# EAGLE schematic regBlock_slice (EAGLE 6.3)
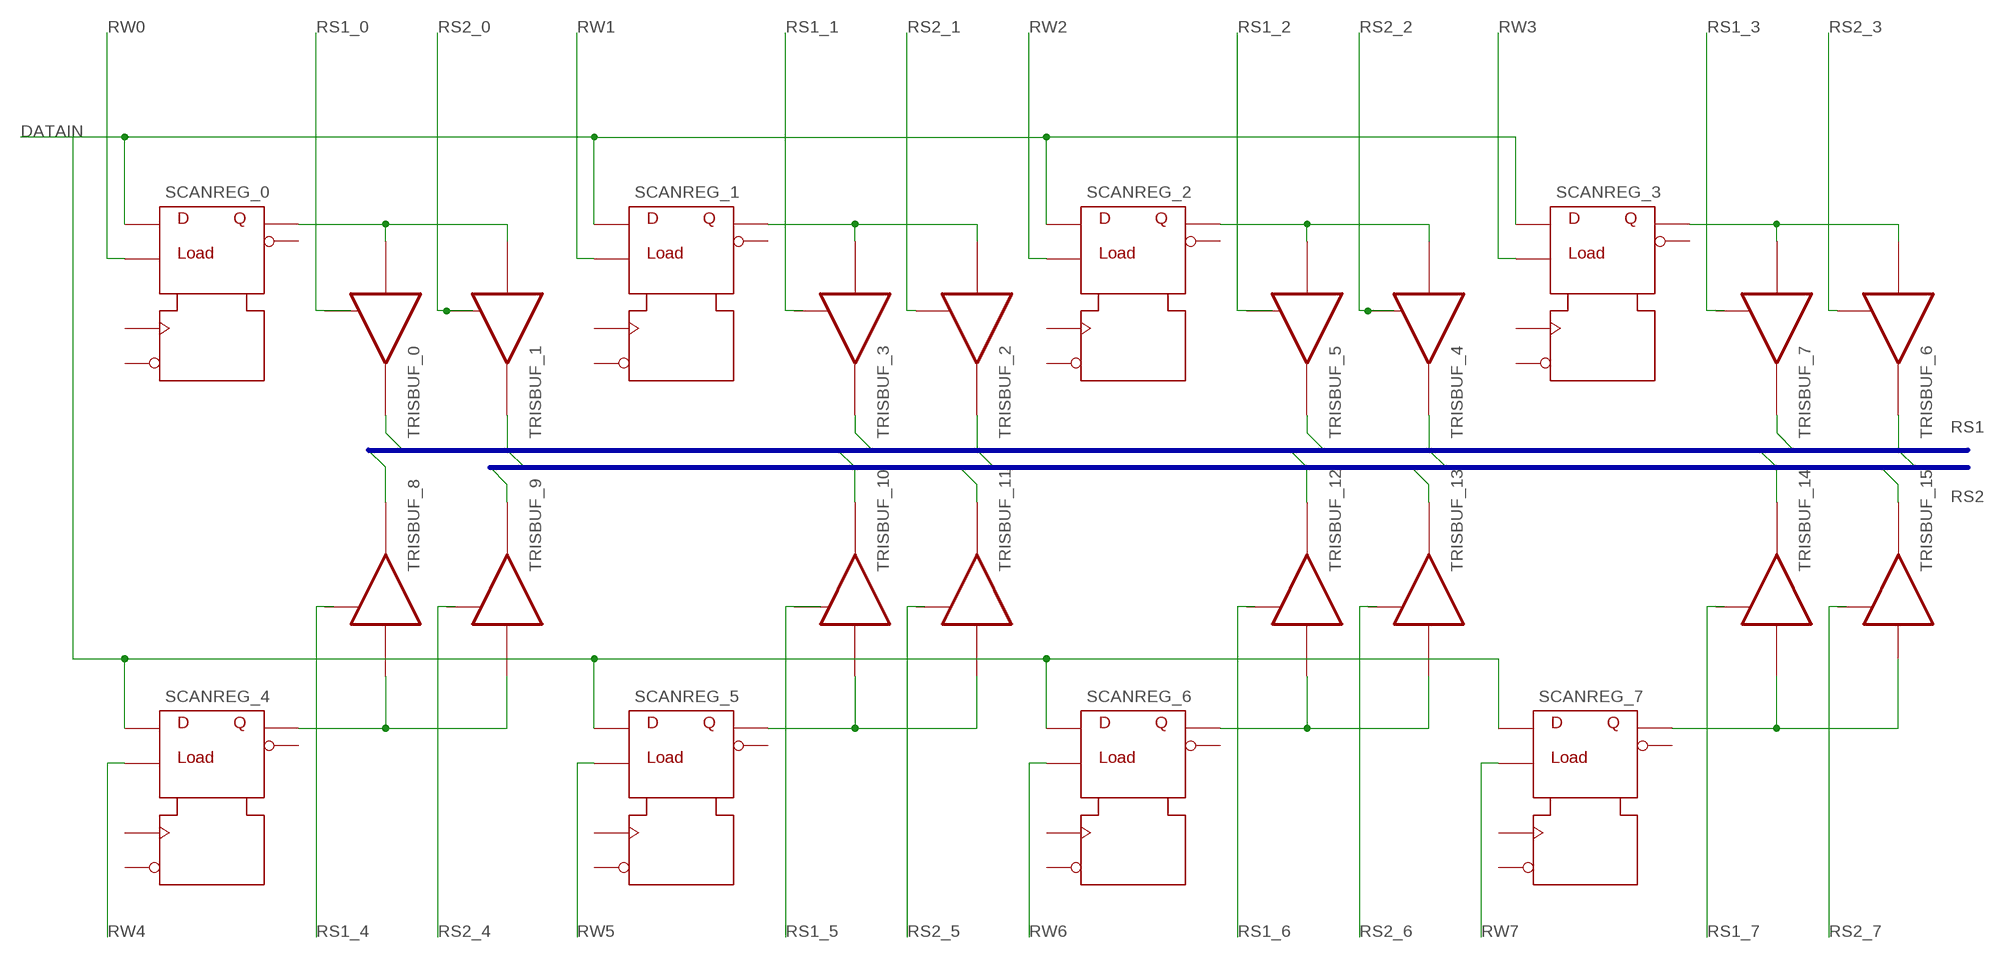
[diagram p0: schematic, sheet 1]

## Parts
SCANREG_0  SCANREG  [6PIN]
SCANREG_1  SCANREG  [6PIN]
SCANREG_2  SCANREG  [6PIN]
SCANREG_3  SCANREG  [6PIN]
SCANREG_4  SCANREG  [6PIN]
SCANREG_5  SCANREG  [6PIN]
SCANREG_6  SCANREG  [6PIN]
SCANREG_7  SCANREG  [6PIN]
TRISBUF_0  TRISBUF  [3PIN]
TRISBUF_1  TRISBUF  [3PIN]
TRISBUF_2  TRISBUF  [3PIN]
TRISBUF_3  TRISBUF  [3PIN]
TRISBUF_4  TRISBUF  [3PIN]
TRISBUF_5  TRISBUF  [3PIN]
TRISBUF_6  TRISBUF  [3PIN]
TRISBUF_7  TRISBUF  [3PIN]
TRISBUF_8  TRISBUF  [3PIN]
TRISBUF_9  TRISBUF  [3PIN]
TRISBUF_10  TRISBUF  [3PIN]
TRISBUF_11  TRISBUF  [3PIN]
TRISBUF_12  TRISBUF  [3PIN]
TRISBUF_13  TRISBUF  [3PIN]
TRISBUF_14  TRISBUF  [3PIN]
TRISBUF_15  TRISBUF  [3PIN]

## Nets
B$1: TRISBUF_0.P$2(O) TRISBUF_3.P$2(O) TRISBUF_5.P$2(O) TRISBUF_7.P$2(O) TRISBUF_8.P$2(O) TRISBUF_10.P$2(O) TRISBUF_12.P$2(O) TRISBUF_14.P$2(O)
B$2: TRISBUF_1.P$2(O) TRISBUF_2.P$2(O) TRISBUF_4.P$2(O) TRISBUF_6.P$2(O) TRISBUF_9.P$2(O) TRISBUF_11.P$2(O) TRISBUF_13.P$2(O) TRISBUF_15.P$2(O)
DATAIN: SCANREG_0.P$2(D) SCANREG_1.P$2(D) SCANREG_2.P$2(D) SCANREG_3.P$2(D) SCANREG_4.P$2(D) SCANREG_5.P$2(D) SCANREG_6.P$2(D) SCANREG_7.P$2(D)
N$1: SCANREG_0.P$6(Q) TRISBUF_0.P$1(I) TRISBUF_1.P$1(I)
N$2: SCANREG_1.P$6(Q) TRISBUF_2.P$1(I) TRISBUF_3.P$1(I)
N$3: SCANREG_2.P$6(Q) TRISBUF_4.P$1(I) TRISBUF_5.P$1(I)
N$4: SCANREG_3.P$6(Q) TRISBUF_6.P$1(I) TRISBUF_7.P$1(I)
N$5: SCANREG_4.P$6(Q) TRISBUF_8.P$1(I) TRISBUF_9.P$1(I)
N$7: SCANREG_5.P$6(Q) TRISBUF_10.P$1(I) TRISBUF_11.P$1(I)
N$8: SCANREG_6.P$6(Q) TRISBUF_12.P$1(I) TRISBUF_13.P$1(I)
N$9: SCANREG_7.P$6(Q) TRISBUF_14.P$1(I)
RS2_0: TRISBUF_1.P$3
RS2_1: TRISBUF_2.P$3
RS2_2: TRISBUF_4.P$3
RS2_3: TRISBUF_6.P$3
RW0: SCANREG_0.P$3(LOAD)
RW1: SCANREG_1.P$3(LOAD)
RW2: SCANREG_2.P$3(LOAD)
RW3: SCANREG_3.P$3(LOAD)
RW4: SCANREG_4.P$3(LOAD)
RW5: SCANREG_5.P$3(LOAD)
RW6: SCANREG_6.P$3(LOAD)
RW7: SCANREG_7.P$3(LOAD)
Unconnected: SCANREG_0.P$1(CLOCK) SCANREG_0.P$4(NQ) SCANREG_0.P$5(NRESET) SCANREG_1.P$1(CLOCK) SCANREG_1.P$4(NQ) SCANREG_1.P$5(NRESET) SCANREG_2.P$1(CLOCK) SCANREG_2.P$4(NQ) SCANREG_2.P$5(NRESET) SCANREG_3.P$1(CLOCK) SCANREG_3.P$4(NQ) SCANREG_3.P$5(NRESET) SCANREG_4.P$1(CLOCK) SCANREG_4.P$4(NQ) SCANREG_4.P$5(NRESET) SCANREG_5.P$1(CLOCK) SCANREG_5.P$4(NQ) SCANREG_5.P$5(NRESET) SCANREG_6.P$1(CLOCK) SCANREG_6.P$4(NQ) SCANREG_6.P$5(NRESET) SCANREG_7.P$1(CLOCK) SCANREG_7.P$4(NQ) SCANREG_7.P$5(NRESET) TRISBUF_0.P$3 TRISBUF_3.P$3 TRISBUF_5.P$3 TRISBUF_7.P$3 TRISBUF_8.P$3 TRISBUF_9.P$3 TRISBUF_10.P$3 TRISBUF_11.P$3 TRISBUF_12.P$3 TRISBUF_13.P$3 TRISBUF_14.P$3 TRISBUF_15.P$1(I) TRISBUF_15.P$3

## Buses
RS1
RS2

## Library data of the parts
SCANREG_0 SCANREG_1-SCANREG_7 = c035u:SCANREG
TRISBUF_0 TRISBUF_1-TRISBUF_15 = c035u:TRISBUF